# Altium schematic sheet [05]Ethernet.SchDoc
size A4
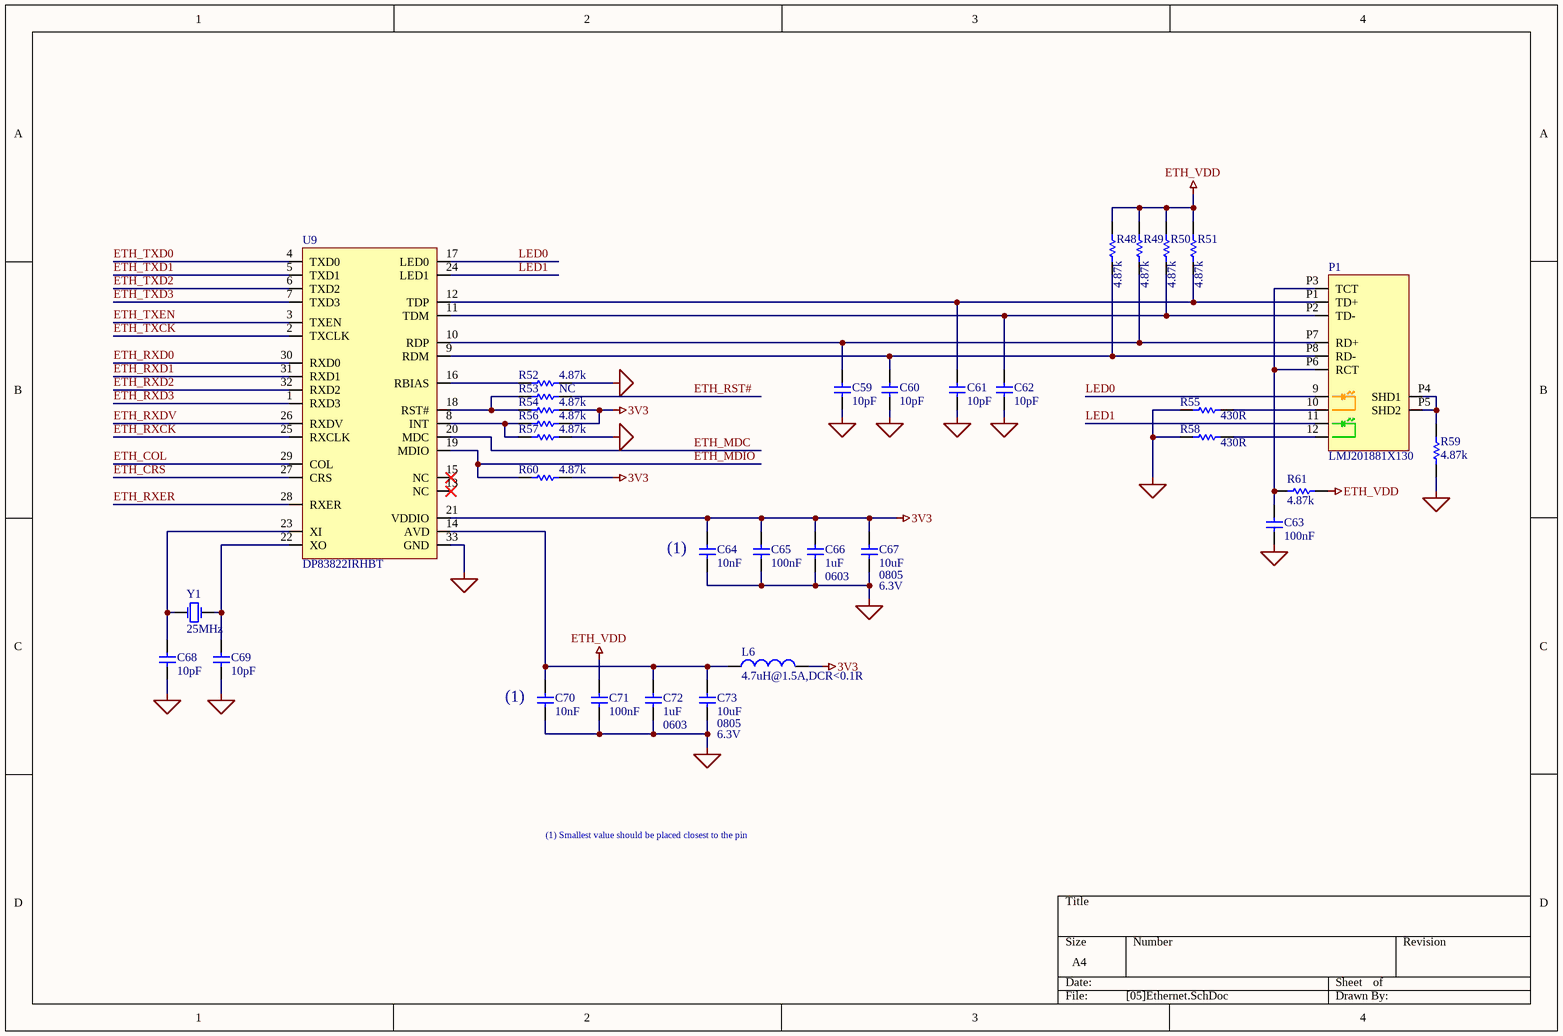
[diagram p0: [05]Ethernet.SchDoc]

## Parts
C59  value 10pF  [C0402]  (hidden comment: SMD Capacitor Chip)
C60  value 10pF  [C0402]  (hidden comment: SMD Capacitor Chip)
C61  value 10pF  [C0402]  (hidden comment: SMD Capacitor Chip)
C62  value 10pF  [C0402]  (hidden comment: SMD Capacitor Chip)
C63  value 100nF  [C0402]  (hidden comment: SMD Capacitor Chip)
C64  value 10nF  [C0402]  (hidden comment: SMD Capacitor Chip)
C65  value 100nF  [C0402]  (hidden comment: SMD Capacitor Chip)
C66  value 1uF  Package / Case: 0603  [C0603]  (hidden comment: SMD Capacitor Chip)
C67  value 10uF  Voltage: 6.3V  Package / Case: 0805  [C0805]  (hidden comment: SMD Capacitor Chip)
C68  value 10pF  [C0402]  (hidden comment: SMD Capacitor Chip)
C69  value 10pF  [C0402]  (hidden comment: SMD Capacitor Chip)
C70  value 10nF  [C0402]  (hidden comment: SMD Capacitor Chip)
C71  value 100nF  [C0402]  (hidden comment: SMD Capacitor Chip)
C72  value 1uF  Package / Case: 0603  [C0603]  (hidden comment: SMD Capacitor Chip)
C73  value 10uF  Voltage: 6.3V  Package / Case: 0805  [C0805]  (hidden comment: SMD Capacitor Chip)
L6  value 4.7uH@1.5A,DCR<0.1R  (hidden comment: SMD Coil Chip)
P1  MPN: LMJ201881X130  (hidden comment: RJ45 Connector)
R48  value 4.87k  (hidden comment: SMD Resistor Chip)
R49  value 4.87k  (hidden comment: SMD Resistor Chip)
R50  value 4.87k  (hidden comment: SMD Resistor Chip)
R51  value 4.87k  (hidden comment: SMD Resistor Chip)
R52  value 4.87k  (hidden comment: SMD Resistor Chip)
R53  value NC  (hidden comment: SMD Resistor Chip)
R54  value 4.87k  (hidden comment: SMD Resistor Chip)
R55  value 430R  (hidden comment: SMD Resistor Chip)
R56  value 4.87k  (hidden comment: SMD Resistor Chip)
R57  value 4.87k  (hidden comment: SMD Resistor Chip)
R58  value 430R  (hidden comment: SMD Resistor Chip)
R59  value 4.87k  (hidden comment: SMD Resistor Chip)
R60  value 4.87k  (hidden comment: SMD Resistor Chip)
R61  value 4.87k  (hidden comment: SMD Resistor Chip)
U9  MPN: DP83822IRHBT  (hidden comment: SMD Ethernet PHY)
Y1  Frequency: 25MHz  (hidden comment: XTAL)

## Nets
3V3: C64.2 C65.2 C66.1 C67.1 L6.2 R54.2 R56.2 R60.2 U9.21(VDDIO)
ETH_VDD: C71.2 R48.2 R49.2 R50.2 R51.2 R61.1
SGND: C59.1 C60.1 C61.1 C62.1 C63.1 C64.1 C65.1 C66.2 C67.2 C68.2 C69.2 C70.1 C71.1 C72.2 C73.2 R52.2 R55.2 R57.2 R58.2 R59.2 U9.33(GND)
ETH_COL: U9.29(COL)
ETH_CRS: U9.27(CRS)
ETH_MDC: U9.20(MDC)
ETH_MDIO: R60.1 U9.19(MDIO)
ETH_RST#: R53.2
ETH_RXCK: U9.25(RXCLK)
ETH_RXD0: U9.30(RXD0)
ETH_RXD1: U9.31(RXD1)
ETH_RXD2: U9.32(RXD2)
ETH_RXD3: U9.1(RXD3)
ETH_RXDV: U9.26(RXDV)
ETH_RXER: U9.28(RXER)
ETH_TXCK: U9.2(TXCLK)
ETH_TXD0: U9.4(TXD0)
ETH_TXD1: U9.5(TXD1)
ETH_TXD2: U9.6(TXD2)
ETH_TXD3: U9.7(TXD3)
ETH_TXEN: U9.3(TXEN)
LED0: P1.9 U9.17(LED0)
LED1: P1.11 U9.24(LED1)
NetC59_2: C59.2 P1.P7(RD+) R49.1 U9.10(RDP)
NetC60_2: C60.2 P1.P8(RD-) R48.1 U9.9(RDM)
NetC61_2: C61.2 P1.P1(TD+) R51.1 U9.12(TDP)
NetC62_2: C62.2 P1.P2(TD-) R50.1 U9.11(TDM)
NetC63_2: C63.2 P1.P3(TCT) P1.P6(RCT) R61.2
NetC68_1: C68.1 U9.23(XI) Y1.2(OSC2)
NetC69_1: C69.1 U9.22(XO) Y1.1(OSC1)
NetC70_2: C70.2 C72.1 C73.1 L6.1 U9.14(AVD)
NetP1_10: P1.10 R55.1
NetP1_12: P1.12 R58.1
NetP1_P4: P1.P4(SHD1) P1.P5(SHD2) R59.1
NetR52_1: R52.1 U9.16(RBIAS)
NetR53_1: R53.1 R54.1 U9.18(RST#)
NetR56_1: R56.1 R57.1 U9.8(INT)

Not connected (* = marked no-connect by the designer): U9 13(NC)* 15(NC)*

## Notes on the sheet
- (near C64) (1)
- (near C70) (1)
- (1) Smallest value should be placed closest to the pin

## Library data of the parts
C59-C65 C68-C71 = CAP: SMD Capacitor; Tolerance: 20%; Voltage: 50V; MPN: ?; Package / Case: 0402
C66 C72 = CAP: SMD Capacitor; Tolerance: 20%; Voltage: 16V; MPN: ?
C67 C73 = CAP: SMD Capacitor; Tolerance: 20%; MPN: ?
L6 = COIL: SMD Coil; Current Rating: 1A; Inductance: 4.7uH; MPN: ?; Series Resistance: ?
P1 = RJ45: RJ45 Connector with Magnetics
R48-R61 = RES: SMD Resistor; Tolerance: 1%; Package / Case: 0402; MPN: ?
U9 = DP83822: DP83822 Robust, Low Power 10/100 Mbps Ethernet Physical Layer Transceiver; Manufacturer: Texas Instruments
Y1 = XTAL: SMD Crystal Oscillator; MPN: ?